# EAGLE design Cat_Laser (EAGLE 9.4.2)
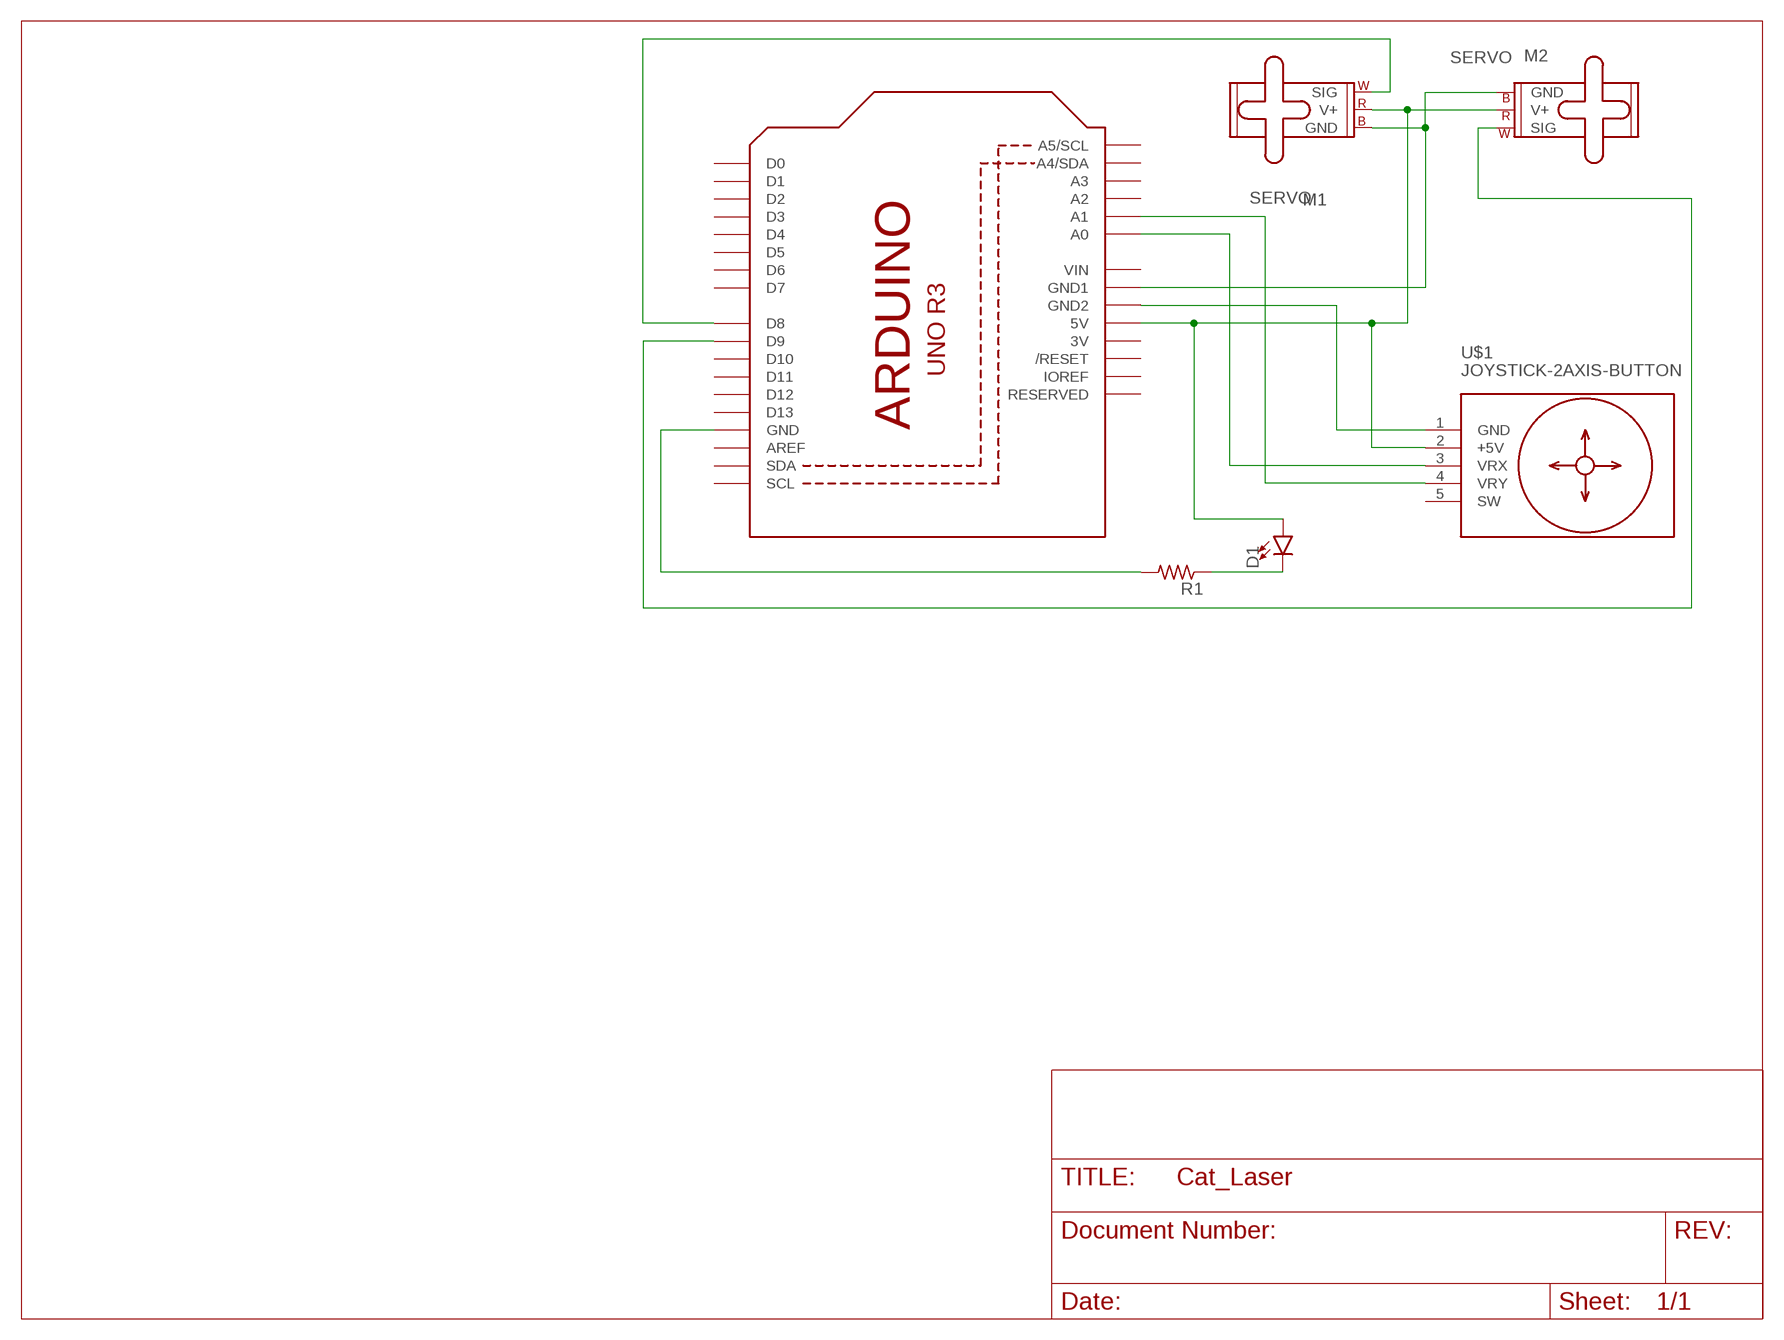
[diagram p0: schematic, sheet 1]

## Parts
D1  LED3MM  [LED_3MM]
M1  SERVO  [1X03]
M2  SERVO  [1X03]
R1  FLIPFLOP-RES  [0805-THM]
U1  ARDUINOR3-BPLACE  [ARDUINOR3-BPLACE]
U$1  JOYSTICK-2AXIS-BUTTON  [JOYSTICK-2AXIS-BUTTON]

## Nets
N$1: M1.3(GND) M2.3(GND) U1.GND1
N$2: U1.GND2 U$1.1(GND)
N$3: D1.A M1.2(V+) M2.2(V+) U1.5V U$1.2(+5V)
N$4: U1.A0 U$1.3(VRX)
N$5: U1.A1 U$1.4(VRY)
N$6: M1.1(SIG) U1.D8
N$7: M2.1(SIG) U1.D9
N$8: R1.2 U1.GND
N$9: D1.K(C) R1.1
Unconnected: U1.A2 U1.A3 U1.A4(A4/SDA) U1.A5(A5/SCL) U1.AREF U1.D0 U1.D1 U1.D2 U1.D3 U1.D4 U1.D5 U1.D6 U1.D7 U1.D10 U1.D11 U1.D12 U1.D13 U1.IOREF U1.RESERVED U1.RESET(/RESET) U1.SCL U1.SDA U$1.5(SW)

## Power pins joined to a net without a drawn wire
3V: U1.3V
VIN: U1.VIN

## Library data of the parts
D1 = SparkFun-LED:LED: LED (Generic) Standard schematic elements and footprints for 5mm, 3mm, 1206, and 0603 sized LEDs. Generic LEDs with no color specified.; PROD_ID: DIO-08794
M1 M2 = SparkFun-Electromechanical:SERVO: Servo Motor 3-pin connector for a standard servo motor (voltage supply, ground, and control signal.) SparkFun Products Servo - Generic (Sub-Micro Size) <https://www.sparkfun.com/products/9065> (ROB-09065) Servo - Generic High Torque Continuous Rotation (Standard Size) <https://www.sparkfun.com/products/9347> (ROB-09347) Servo - Generic High Torque (Standard Size) <https://www.sparkfun.com/products/11965> (ROB-11965)
R1 = adafruit:FLIPFLOP-RES: Flip Flop resistor An 0805 resistor inside a standard 1/4W 5% resistor. Makes for easy mods
U1 = adafruit:ARDUINOR3: This is a new object for the new Arduino R3 - with extra pins that you may want to use (such as IOref, and duplicated A4/A5
U$1 = diy-modules:JOYSTICK-2AXIS-BUTTON: 2-Axis Analog Joystick with Push Button Tutorial is available here: http://henrysbench.capnfatz.com/henrys-bench/arduino-sensors-and-input/arduino-ps2-joystick-tutorial-keyes-ky-023-deek-robot/ Click here to find device on ebay.com <http://www.ebay.com/sch/joystick+ps2+module>

## Board
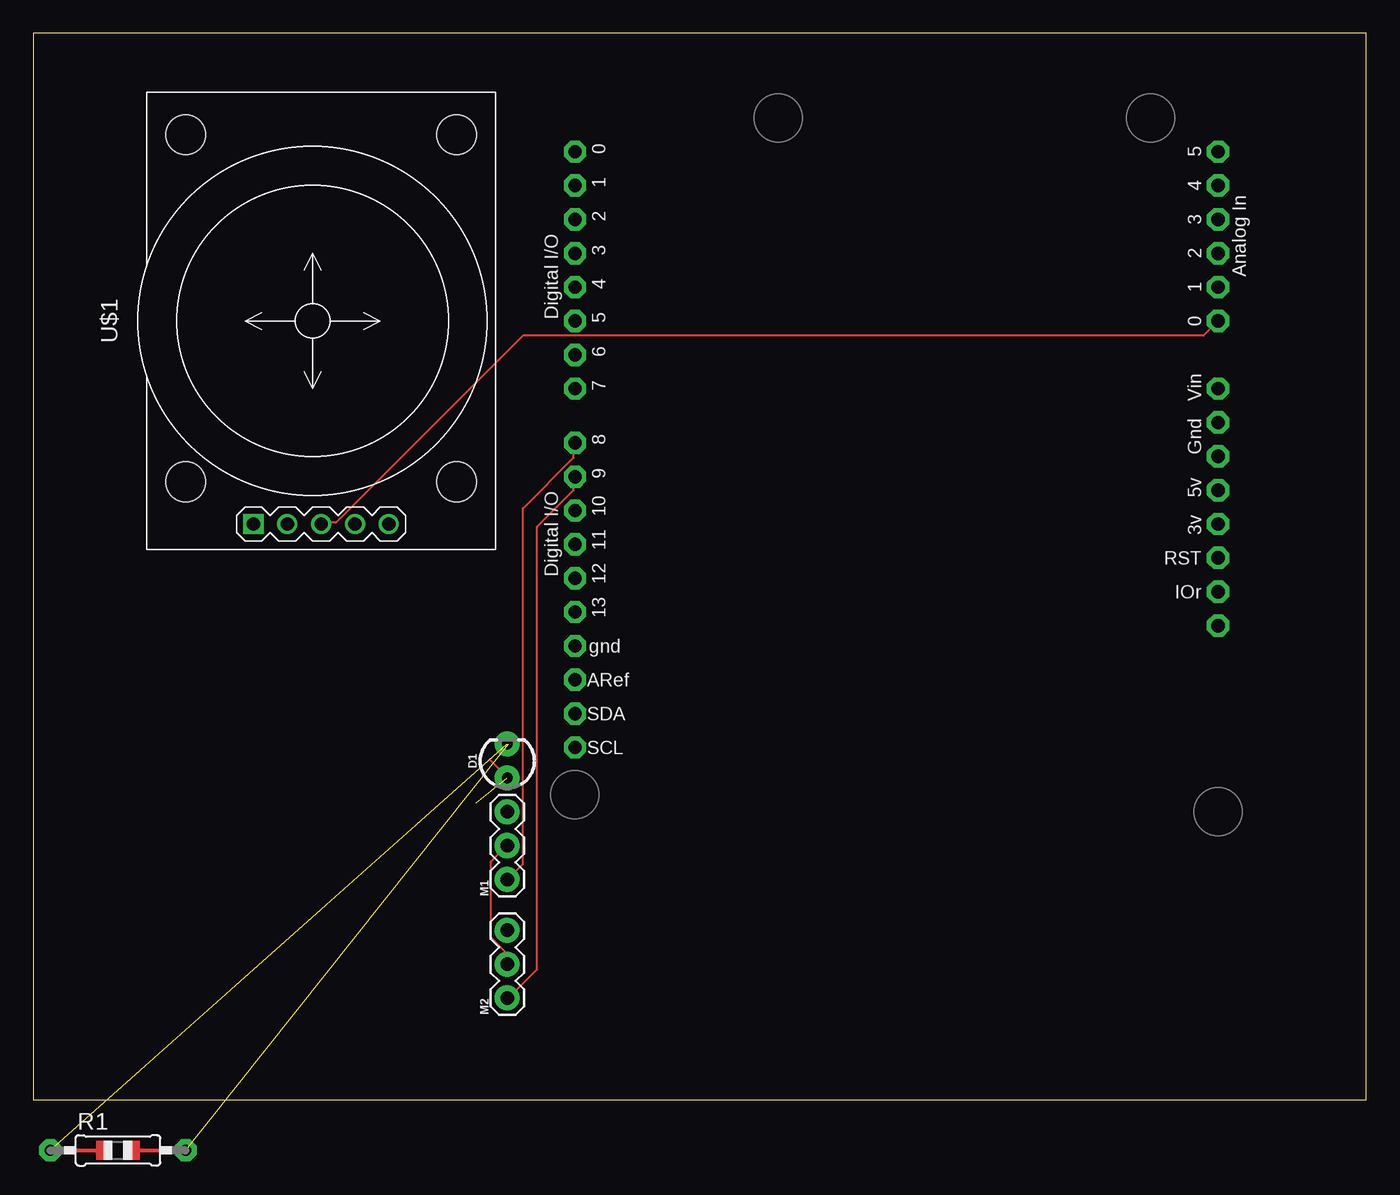
[diagram p1: board, top side]
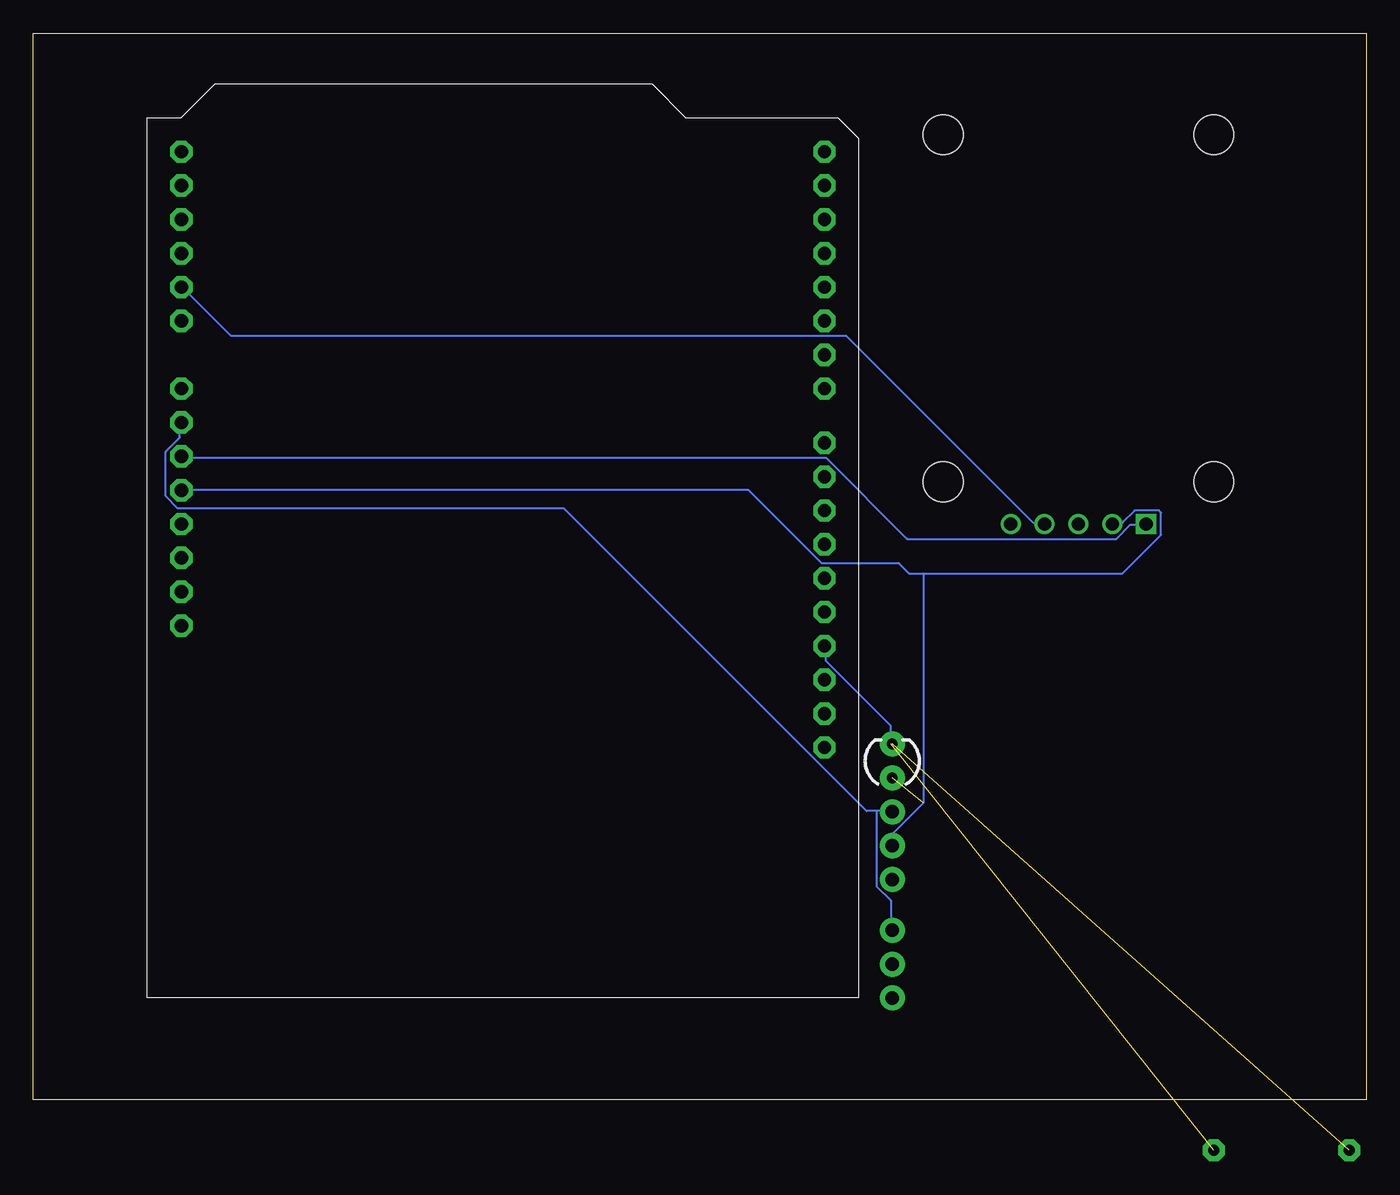
[diagram p2: board, bottom side, seen from below]

Size 100 x 80 mm. Coordinates in mm from the lower left corner, seen from the top.
Outline: 0,0 100,0 100,80 0,80 0,0
Copper layers (1*16): Top 0.035mm / dielectric 1.5mm / Bottom 0.035mm
Design rules "default": minimum track width 6mil, minimum drill 0.35mm, track to track 6mil, track to pad 6mil, pad to pad 6mil, via to via 6mil, smd to smd 6mil, copper to edge 40mil, drill to drill 6mil, minimum pad ring 10mil, minimum via ring 8mil, stop-mask expansion 4mil, vias tented up to drill 0mil, thermal gap 10mil

### Footprints (pad centres in the part's own frame; a part is rotated, then mirrored left to right if it is on the bottom)
LED_3MM = drill 0.813 pad 1.88: A -1.27,0; K 1.27,0
1X03 = drill 1.016 pad 1.88: 1 0,0; 2 2.54,0; 3 5.08,0
0805-THM = drill 0.813 pad 1.676 octagon: 1 -5.08,0; 2 5.08,0
ARDUINOR3-BPLACE = drill 1 pad 1.676 octagon: 3V 35.56,2.54; 5V 38.1,2.54; A0 50.8,2.54; A1 53.34,2.54; A2 55.88,2.54; A3 58.42,2.54; A4 60.96,2.54; A5 63.5,2.54; AREF 23.876,50.8; D0 63.5,50.8; D1 60.96,50.8; D2 58.42,50.8; D3 55.88,50.8; D4 53.34,50.8; D5 50.8,50.8; D6 48.26,50.8; D7 45.72,50.8; D8 41.656,50.8; D9 39.116,50.8; D10 36.576,50.8; D11 34.036,50.8; D12 31.496,50.8; D13 28.956,50.8; GND 26.416,50.8; GND1 43.18,2.54; GND2 40.64,2.54; IOREF 30.48,2.54; RESERVED 27.94,2.54; RESET 33.02,2.54; SCL 18.796,50.8; SDA 21.336,50.8; VIN 45.72,2.54
JOYSTICK-2AXIS-BUTTON = drill 1 square: 1 -15.24,5.08 | drill 1: 2 -15.24,2.54; 3 -15.24,0; 4 -15.24,-2.54; 5 -15.24,-5.08 | hole 3: -12.065,10.16; -12.065,-10.16; 13.97,-10.16; 13.97,10.16

### Placement (x,y rotation side)
D1  35.56,25.4 90 top
M1  35.56,16.51 90 top
M2  35.56,7.62 90 top
R1  6.35,-3.81 0 top  (outside the outline)
U1  91.44,7.62 90 top
U$1  21.59,58.42 90 top

### Tracks (layer width: path | path; a pad name or v marks a point on that pad's centre or on a via)
N$1
  Bottom 0.152: 36.73,21.64 35.66,21.64 M1.3 | 36.73,21.64 37.49,21.64 60.2,44.35 89.15,44.35 90.07,45.26 90.07,48.62 89,49.68 89,50.75 U1.GND1 | 36.73,21.64 36.73,16 35.66,14.94 35.66,12.8 M2.3
N$2
  Bottom 0.152: U$1.1 16.61,43.13 17.68,43.13 18.75,42.06 34.44,42.06 40.54,48.16 88.85,48.16 U1.GND2
N$3  (1 unrouted)
  Top 0.152: M2.2 35.51,10.21 35.51,10.97 34.29,12.19 34.29,17.83 35.51,19.05 M1.2 | 34.29,25.45 35.51,24.23 D1.A
  Bottom 0.152: 33.22,39.47 34.29,39.47 35.05,40.23 40.84,40.23 46.33,45.72 U1.5V | 33.22,39.47 18.29,39.47 15.39,42.37 15.39,44.04 15.54,44.2 17.37,44.2 18.29,43.28 19.05,43.28 U$1.2 | 33.22,39.47 33.22,22.25 35.51,19.96 35.51,19.05 M1.2
N$4
  Top 0.152: U1.A0 87.78,57.3 36.73,57.3 22.71,43.28 21.64,43.28 U$1.3
N$5
  Bottom 0.152: U$1.4 24.23,43.28 24.99,43.28 39.01,57.3 85.19,57.3 88.85,60.96 U1.A1
N$6
  Top 0.152: M1.1 36.73,17.68 36.73,44.35 40.54,48.16 40.54,49.23 U1.D8
N$7
  Top 0.152: U1.D9 40.54,46.63 40.54,45.72 37.8,42.98 37.8,9.75 35.66,7.62 M2.1
N$8  (1 unrouted)
  Bottom 0.152: 35.66,26.67 35.66,28.04 40.54,32.92 40.54,33.98 U1.GND
N$9  (1 unrouted)